# EAGLE schematic Schématique (EAGLE 9.0.0)

## Sheet 1 of 2: SLAVE
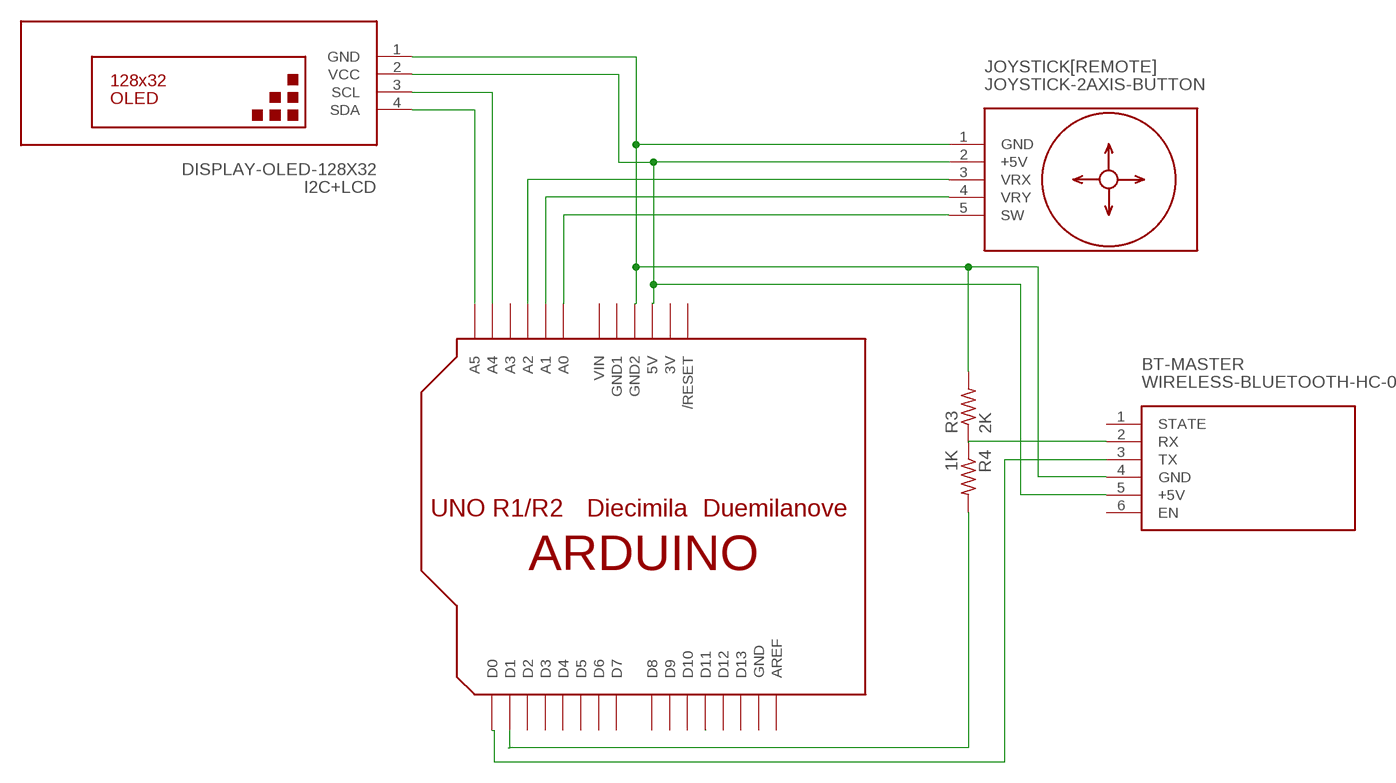
[diagram p0: schematic, sheet 1]

### Parts
BT-MASTER  WIRELESS-BLUETOOTH-HC-05  [WIRELESS-BLUETOOTH-HC-05]
I2C+LCD  DISPLAY-OLED-128X32  [DISPLAY-OLED-128X32]
JOYSTICK[REMOTE]  JOYSTICK-2AXIS-BUTTON  [JOYSTICK-2AXIS-BUTTON]
R3  2K  R-US_0207/7  [0207/7]
R4  1K  R-US_0207/7  [0207/7]
SLAVE  ARDUINOUNO  [ARDUINO]

### Nets
N$1: I2C+LCD.4(SDA) SLAVE.A5
N$2: I2C+LCD.3(SCL) SLAVE.A4
N$3: R4.2 SLAVE.D1
N$4: BT-MASTER.2(RX) R3.1
N$5: SLAVE.D11
N$8: JOYSTICK[REMOTE].5(SW) SLAVE.A0
N$9: JOYSTICK[REMOTE].4(VRY) SLAVE.A1
N$10: JOYSTICK[REMOTE].3(VRX) SLAVE.A2
N$11: BT-MASTER.5(+5V) I2C+LCD.2(VCC) JOYSTICK[REMOTE].2(+5V) SLAVE.5V
N$12: BT-MASTER.4(GND) I2C+LCD.1(GND) JOYSTICK[REMOTE].1(GND) R3.2 SLAVE.GND2
N$16: BT-MASTER.3(TX) SLAVE.D0
Unconnected: BT-MASTER.1(STATE) BT-MASTER.6(EN) R4.1 SLAVE.A3 SLAVE.AREF SLAVE.D2 SLAVE.D3 SLAVE.D4 SLAVE.D5 SLAVE.D6 SLAVE.D7 SLAVE.D8 SLAVE.D9 SLAVE.D10 SLAVE.D12 SLAVE.D13 SLAVE.RESET(/RESET)

## Sheet 2 of 2: MASTER
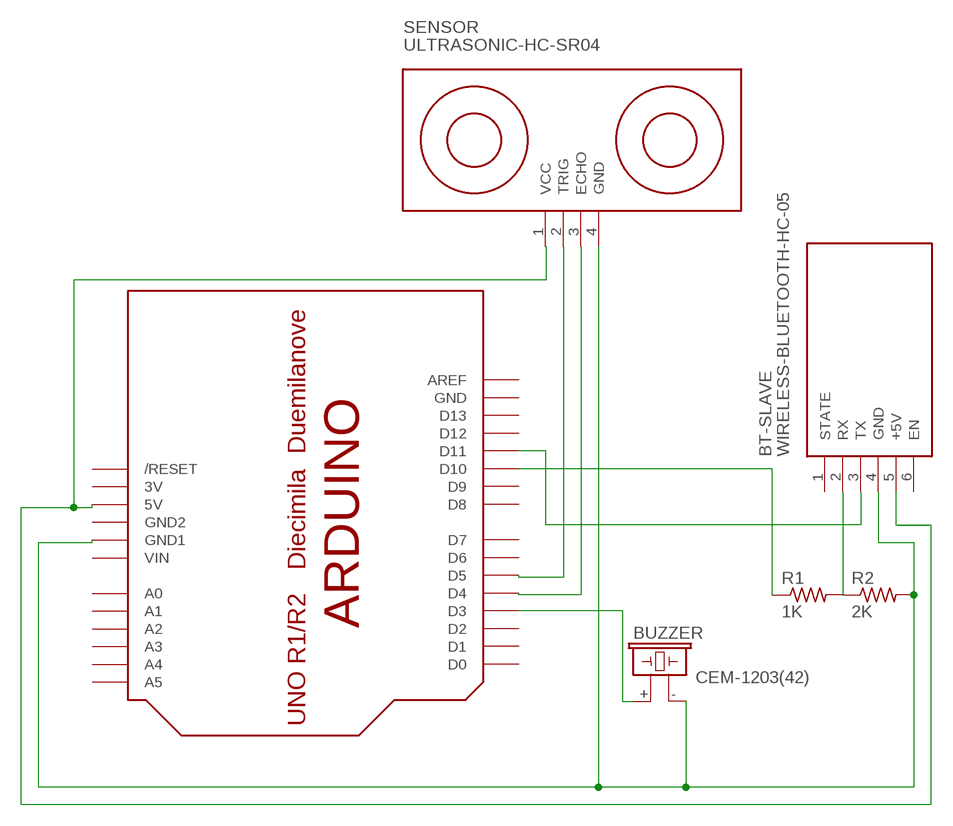
[diagram p1: schematic, sheet 2]

### Parts
BT-SLAVE  WIRELESS-BLUETOOTH-HC-05  [WIRELESS-BLUETOOTH-HC-05]
BUZZER  CEM-1203(42)  F/CM04P  [F/CM04P]
MASTER  ARDUINOUNO  [ARDUINO]
R1  1K  R-US_0207/7  [0207/7]
R2  2K  R-US_0207/7  [0207/7]
SENSOR  ULTRASONIC-HC-SR04  [ULTRASONIC-HC-SR04]

### Nets
N$6: BT-SLAVE.3(TX) MASTER.D11
N$7: BT-SLAVE.4(GND) BUZZER.- MASTER.GND1 R2.2 SENSOR.4(GND)
N$13: BT-SLAVE.2(RX) R1.2
N$14: MASTER.D10 R1.1
N$15: BT-SLAVE.5(+5V) MASTER.5V SENSOR.1(VCC)
N$17: MASTER.D5 SENSOR.2(TRIG)
N$18: MASTER.D4 SENSOR.3(ECHO)
N$19: BUZZER.+ MASTER.D3
Unconnected: BT-SLAVE.1(STATE) BT-SLAVE.6(EN) MASTER.A0 MASTER.A1 MASTER.A2 MASTER.A3 MASTER.A4 MASTER.A5 MASTER.AREF MASTER.D0 MASTER.D1 MASTER.D2 MASTER.D6 MASTER.D7 MASTER.D8 MASTER.D9 MASTER.D12 MASTER.D13 MASTER.RESET(/RESET) R2.1

## Power pins joined to a net without a drawn wire
3V: MASTER.3V SLAVE.3V
GND: MASTER.GND SLAVE.GND
GND1: SLAVE.GND1
GND2: MASTER.GND2
VIN: MASTER.VIN SLAVE.VIN

## Library data of the parts
BT-MASTER BT-SLAVE = diy-modules:WIRELESS-BLUETOOTH-HC-05: Bluetooth Transceiver Module based on HC-05 board Tutorial is available here: https://arduino-info.wikispaces.com/BlueTooth-HC05-HC06-Modules-How-To Click here to find device on ebay.com <http://www.ebay.com/sch/hc-05+module+rs232>
BUZZER = buzzer:F/CM04P: BUZZER Source: Buerklin; OC_FARNELL: unknown; OC_NEWARK: unknown
I2C+LCD = diy-modules:DISPLAY-OLED-128X32: 128x32 Dot Matrix OLED Module with I2C interface based on SSD1306 chip More details available here: http://www.tinyosshop.com/index.php?route=product/product&product_id=953 Schematic available here: http://www.tinyosshop.com/datasheet/OLED%2012832.pdf SSD1306 datasheet: https://cdn-shop.adafruit.com/datasheets/SSD1306.pdf Click here to find device on ebay.com <http://www.ebay.com/sch/oled+display+128x32+i2c>
JOYSTICK[REMOTE] = diy-modules:JOYSTICK-2AXIS-BUTTON: 2-Axis Analog Joystick with Push Button Tutorial is available here: http://henrysbench.capnfatz.com/henrys-bench/arduino-sensors-and-input/arduino-ps2-joystick-tutorial-keyes-ky-023-deek-robot/ Click here to find device on ebay.com <http://www.ebay.com/sch/joystick+ps2+module>
MASTER SLAVE = adafruit:ARDUINO: Arduino Diecimila/Duemilanove Make a shield with ease, this package has all the named pins as well as the two mounting drill holes and an outline of the USB and DC power connector. The outline is on the DIMENSION layer, so if your board house uses it they will cut the outline to match. http://www.ladyada.net/library/pcb/eaglelibrary.html
R1-R4 = resistor:R-US_: RESISTOR, American symbol
SENSOR = diy-modules:ULTRASONIC-HC-SR04: Ultrasonic Ranging Module HC-SR04 More details available here: http://randomnerdtutorials.com/complete-guide-for-ultrasonic-sensor-hc-sr04/ Click here to find device on ebay.com <http://www.ebay.com/sch/hc+sr04+ultrasonic>

## Module MOTOR
Ports: 

### Library data of the parts